# Altium schematic sheet Power.SchDoc
size A4
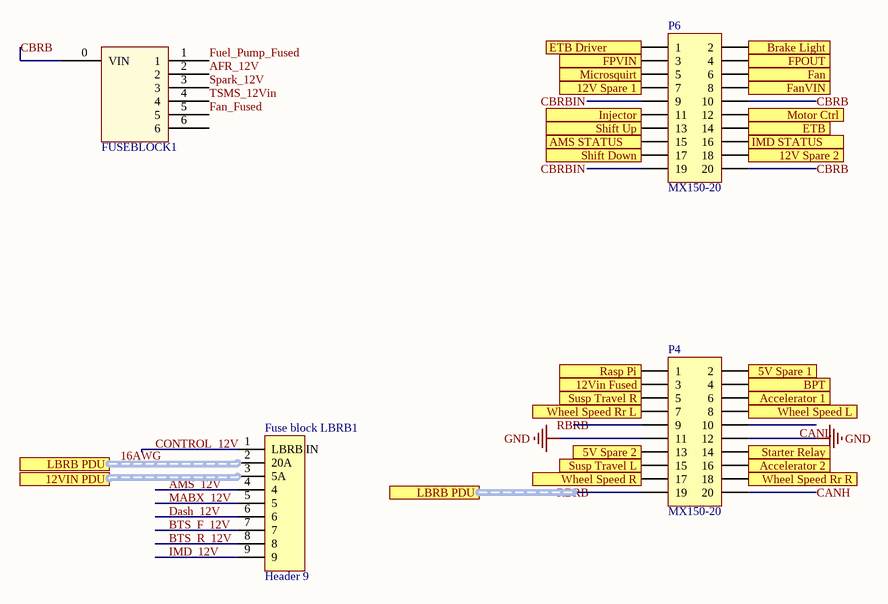
[diagram p0: Power.SchDoc]

## Parts
Fuse_block_LBRB1  Header 9  [HDR1X9]
FUSEBLOCK1  FuseBlock  (value not drawn)
P4  MX150-20  [MX150 20 PIN]
P6  MX150-20  [MX150 20 PIN]

## Ports
5V Spare 1, 5V Spare 2, 12V Spare 1, 12V Spare 2, 12Vin Fused, 12VIN PDU (harness Reset), Accelerator 1, Accelerator 2, AMS STATUS, BPT, Brake Light, ETB, ETB Driver, Fan, FanVIN, FPOUT, FPVIN, IMD STATUS, Injector, LBRB PDU (harness Reset), Microsquirt, Motor Ctrl, Rasp Pi, Shift Down, Shift Up, Starter Relay, Susp Travel L, Susp Travel R, Wheel Speed L, Wheel Speed R, Wheel Speed Rr L, Wheel Speed Rr R

## Nets
GND: P4.11 P4.12
5V Spare 1: P4.2 ; port 5V Spare 1
5V Spare 2: P4.13 ; port 5V Spare 2
12V Spare 1: P6.7 ; port 12V Spare 1
12V Spare 2: P6.18 ; port 12V Spare 2
12Vin Fused: P4.3 ; port 12Vin Fused
Accelerator 1: P4.6 ; port Accelerator 1
Accelerator 2: P4.16 ; port Accelerator 2
AFR_12V: FUSEBLOCK1.2
AMS STATUS: P6.15 ; port AMS STATUS
BPT: P4.4 ; port BPT
Brake Light: P6.2 ; port Brake Light
CANH: P4.20
CANL: P4.10
CBRB: FUSEBLOCK1.0(VIN) P6.10 P6.20
CBRBIN: P6.9 P6.19
ETB: P6.14 ; port ETB
ETB Driver: P6.1 ; port ETB Driver
Fan: P6.6 ; port Fan
Fan_Fused: FUSEBLOCK1.5
FanVIN: P6.8 ; port FanVIN
FPOUT: P6.4 ; port FPOUT
FPVIN: P6.3 ; port FPVIN
Fuel_Pump_Fused: FUSEBLOCK1.1
IMD STATUS: P6.16 ; port IMD STATUS
Injector: P6.11 ; port Injector
Microsquirt: P6.5 ; port Microsquirt
Motor Ctrl: P6.12 ; port Motor Ctrl
Rasp Pi: P4.1 ; port Rasp Pi
RBRB: P4.9 P4.19
Shift Down: P6.17 ; port Shift Down
Shift Up: P6.13 ; port Shift Up
Spark_12V: FUSEBLOCK1.3
Starter Relay: P4.14 ; port Starter Relay
Susp Travel L: P4.15 ; port Susp Travel L
Susp Travel R: P4.5 ; port Susp Travel R
TSMS_12Vin: FUSEBLOCK1.4
Wheel Speed L: P4.8 ; port Wheel Speed L
Wheel Speed R: P4.17 ; port Wheel Speed R
Wheel Speed Rr L: P4.7 ; port Wheel Speed Rr L
Wheel Speed Rr R: P4.18 ; port Wheel Speed Rr R

Not connected (* = marked no-connect by the designer): Fuse_block_LBRB1 1(LBRB_IN) 2(20A) 3(5A) 4 5 6 7 8 9; FUSEBLOCK1 6

## Buses and harness runs
harness 16AWG = port LBRB PDU

## Notes on the sheet
- Labels drawn without touching a wire or pin: AMS_12V, BTS_F_12V, BTS_R_12V, CONTROL_12V, Dash_12V, IMD_12V, MABX_12V

## Library data of the parts
Fuse_block_LBRB1 = Header 9: Header, 9-Pin; LatestRevisionDate: 17-Jul-2002; LatestRevisionNote: Re-released for DXP Platform.; Publisher: Altium Limited
FUSEBLOCK1 = FuseBlock: Iztor 6 Way Light Fuse Box Block; Link: https://www.amazon.ca/Terminal-Single-Package-Accessories-Motorhomes/dp/B074K1TJNL/ref=sr_1_9?s=electronics&ie=UTF8&qid=1544502475&sr=1-9&keywords=6+way+fuse+box
P4 P6 = Header 10X2: Header, 10-Pin, Dual row; LatestRevisionDate: 17-Jul-2002; LatestRevisionNote: Re-released for DXP Platform.; Publisher: Altium Limited; Supplier Part Number: WM12752-ND